# Altium schematic sheet TUSB2036_PINOUT.SchDoc
size B; SheetNumber: 12; SheetTotal: 17
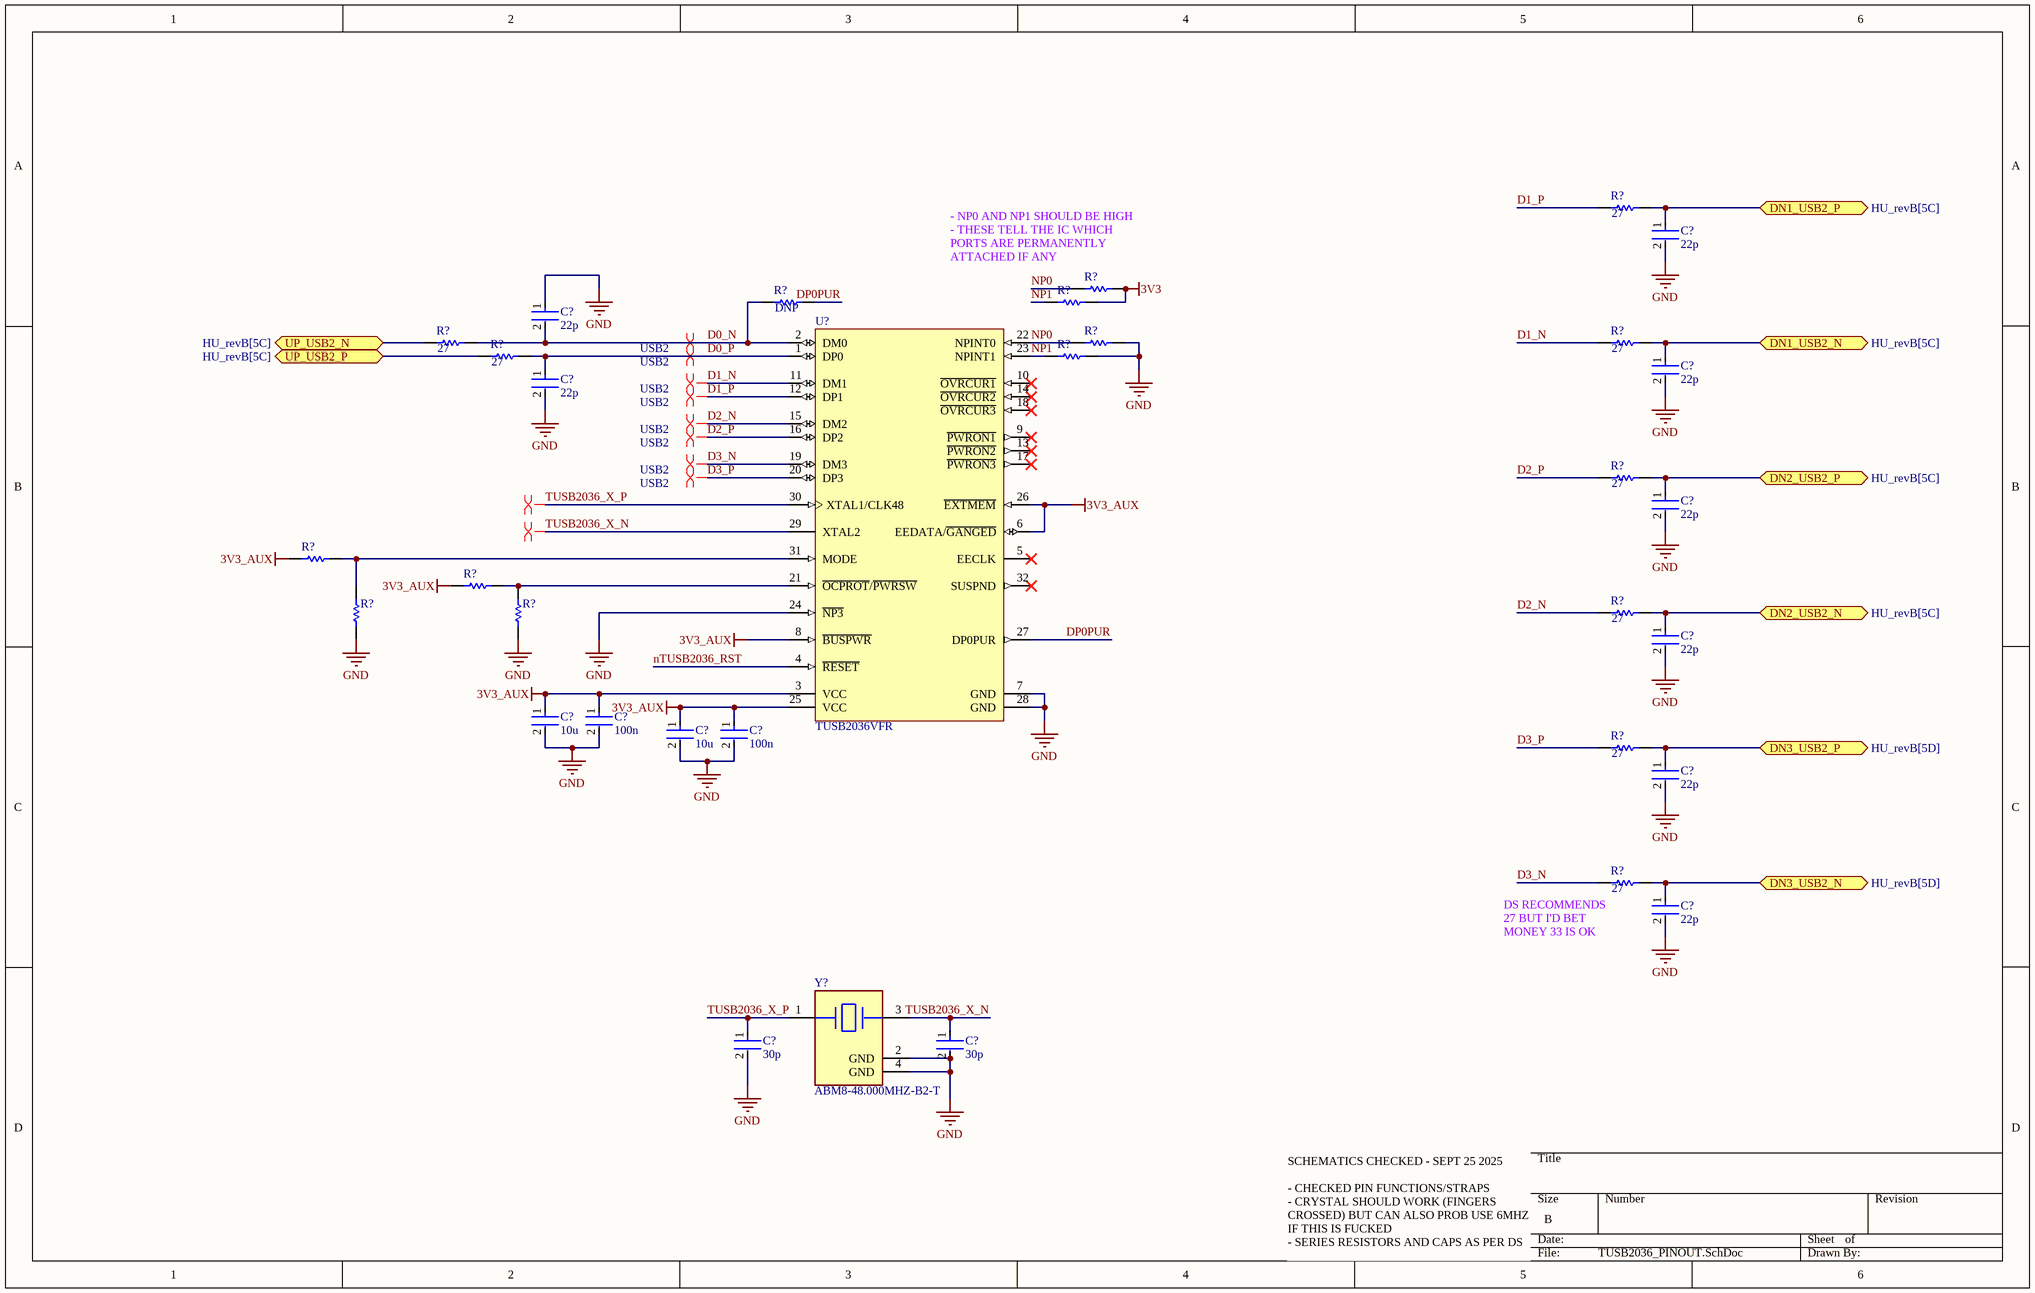
[diagram p0: TUSB2036_PINOUT.SchDoc]

## Parts
(Parts that share a designator on the sheet are numbered #1, #2 ... from top to bottom, then left to right.)
C?#1  22p  [FP-0402-L_1_0_0_05-W_0_5-IPC_A]
C?#2  22p  [FP-0402-L_1_0_0_05-W_0_5-IPC_A]
C?#3  22p  [FP-0402-L_1_0_0_05-W_0_5-IPC_A]
C?#4  22p  [FP-0402-L_1_0_0_05-W_0_5-IPC_A]
C?#5  22p  [FP-0402-L_1_0_0_05-W_0_5-IPC_A]
C?#6  22p  [FP-0402-L_1_0_0_05-W_0_5-IPC_A]
C?#7  10u  [FP-0402-L_1_0_0_05-W_0_5-IPC_A]
C?#8  100n  [FP-0402-L_1_0_0_05-W_0_5-IPC_A]
C?#9  10u  [FP-0402-L_1_0_0_05-W_0_5-IPC_A]
C?#10  100n  [FP-0402-L_1_0_0_05-W_0_5-IPC_A]
C?#11  22p  [FP-0402-L_1_0_0_05-W_0_5-IPC_A]
C?#12  22p  [FP-0402-L_1_0_0_05-W_0_5-IPC_A]
C?#13  30p  [FP-0402-L_1_0_0_05-W_0_5-IPC_A]
C?#14  30p  [FP-0402-L_1_0_0_05-W_0_5-IPC_A]
R?#1  27  [R0603B]
R?#2  0402 JUMPER  [RESC1005X40X25ML05T05]  (value not drawn)
R?#3  0402 JUMPER  [RESC1005X40X25ML05T05]  (value not drawn)
R?#4  DNP  [R0603B]
R?#5  0402 JUMPER  [RESC1005X40X25ML05T05]  (value not drawn)
R?#6  27  [R0603B]
R?#7  0402 JUMPER  [RESC1005X40X25ML05T05]  (value not drawn)
R?#8  27  [R0603B]
R?#9  27  [R0603B]
R?#10  27  [R0603B]
R?#11  0402 JUMPER  [RESC1005X40X25ML05T05]  (value not drawn)
R?#12  0402 JUMPER  [RESC1005X40X25ML05T05]  (value not drawn)
R?#13  27  [R0603B]
R?#14  DNP  [RESC1005X40X25ML05T05]  (value not drawn)
R?#15  DNP  [RESC1005X40X25ML05T05]  (value not drawn)
R?#16  27  [R0603B]
R?#17  27  [R0603B]
U?  TUSB2036VFR  [VF0032A_M]
Y?  ABM8-48.000MHZ-B2-T  [FP-ABM8-MFG]

## Ports
DN1_USB2_N (bidir, see HU_revB[5C]), DN1_USB2_P (bidir, see HU_revB[5C]), DN2_USB2_N (bidir, see HU_revB[5C]), DN2_USB2_P (bidir, see HU_revB[5C]), DN3_USB2_N (bidir, see HU_revB[5D]), DN3_USB2_P (bidir, see HU_revB[5D]), UP_USB2_N (bidir, see HU_revB[5C]), UP_USB2_P (bidir, see HU_revB[5C])

## Nets
3V3: R?#2.2 R?#3.2
3V3_AUX: C?#7.1 C?#8.1 C?#9.1 C?#10.1 R?#11.2 R?#12.2 U?.3(VCC) U?.6(EEDATA/~{GANGED}) U?.8(~{BUSPWR}) U?.25(VCC) U?.26(~{EXTMEM})
GND: C?#1.2 C?#2.1 C?#3.2 C?#4.2 C?#5.2 C?#6.2 C?#7.2 C?#8.2 C?#9.2 C?#10.2 C?#11.2 C?#12.2 C?#13.2 C?#14.2 R?#5.2 R?#7.2 R?#14.1 R?#15.1 U?.7(GND) U?.24(~{NP3}) U?.28(GND) Y?.2(GND) Y?.4(GND)
D0_N: C?#2.2 R?#4.2 R?#6.1 U?.2(DM0)
D0_P: C?#4.1 R?#9.1 U?.1(DP0)
D1_N: R?#8.2 U?.11(DM1)
D1_P: R?#1.2 U?.12(DP1)
D2_N: R?#13.2 U?.15(DM2)
D2_P: R?#10.2 U?.16(DP2)
D3_N: R?#17.2 U?.19(DM3)
D3_P: R?#16.2 U?.20(DP3)
DN1_USB2_N: C?#3.1 R?#8.1 ; port DN1_USB2_N
DN1_USB2_P: C?#1.1 R?#1.1 ; port DN1_USB2_P
DN2_USB2_N: C?#6.1 R?#13.1 ; port DN2_USB2_N
DN2_USB2_P: C?#5.1 R?#10.1 ; port DN2_USB2_P
DN3_USB2_N: C?#12.1 R?#17.1 ; port DN3_USB2_N
DN3_USB2_P: C?#11.1 R?#16.1 ; port DN3_USB2_P
DP0PUR: R?#4.1 U?.27(DP0PUR)
NP0: R?#2.1 R?#5.1 U?.22(NPINT0)
NP1: R?#3.1 R?#7.1 U?.23(NPINT1)
nTUSB2036_RST: U?.4(~{RESET})
TUSB2036_X_N: C?#14.1 U?.29(XTAL2) Y?.3
TUSB2036_X_P: C?#13.1 U?.30(XTAL1/CLK48) Y?.1
UP_USB2_N: R?#6.2 ; port UP_USB2_N
UP_USB2_P: R?#9.2 ; port UP_USB2_P
NetR?#11_1: R?#11.1 R?#14.2 U?.31(MODE)
NetR?#12_1: R?#12.1 R?#15.2 U?.21(~{OCPROT}/~{PWRSW})

Not connected (* = marked no-connect by the designer): U? 5(EECLK)* 9(~{PWRON1})* 10(~{OVRCUR1})* 13(~{PWRON2})* 14(~{OVRCUR2})* 17(~{PWRON3})* 18(~{OVRCUR3})* 32(SUSPND)*

## Layout directives
differential pair: TUSB2036_X_N, TUSB2036_X_P
differential pair; differential pair class USB2: D0_N, D0_P, D1_N, D1_P, D2_N, D2_P, D3_N, D3_P

## Notes on the sheet
- (near R?#2) - NP0 AND NP1 SHOULD BE HIGH
  - THESE TELL THE IC WHICH PORTS ARE PERMANENTLY ATTACHED IF ANY
- (near R?#17) DS RECOMMENDS 27 BUT I'D BET MONEY 33 IS OK
- SCHEMATICS CHECKED - SEPT 25 2025
  - CHECKED PIN FUNCTIONS/STRAPS
  - CRYSTAL SHOULD WORK (FINGERS CROSSED) BUT CAN ALSO PROB USE 6MHZ IF THIS IS FUCKED
  - SERIES RESISTORS AND CAPS AS PER DS

## Library data of the parts
C?#1-C?#14 = CMP-001-00058-1: LARGE PADS, 0402 CAP, CHANGE COMMENT TO MATCH REAL P/N; Capacitor Type: Ceramic; Min Operating Temperature: -55°C; Mounting Technology: Surface Mount; Pins: 2; Case/Package: 0402; RoHS Compliant: Yes; Max Operating Temperature: 85°C
R?#1 R?#4 R?#6 R?#8-R?#10 R?#13 R?#16 R?#17 = CMP-009-00002-14: Resistor
  R?#1 R?#6 R?#8-R?#10 R?#13 R?#16 R?#17: Value: 27
  R?#4: Value: DNP
R?#2 R?#3 R?#5 R?#7 R?#11 R?#12 R?#14 R?#15 = CMP-009-00118-2: READ THE NAME; Pins: 2; Component Type: Standard; Design Item ID: CMP-009-00206-2; Source: 0402jump.SchLib
U? = CMP-0309-00082-2: 2 / 3-Port Hub for USB with Optional Serial EEPROM Interface, 3.3V, 0 to 70 degC, 32-Pin LQFP (VF), Green (RoHS & no Sb/Br); Manufacturer: Texas Instruments; Supply Voltage(s)(V): 3.3; SubFamily: USB Hub Controller; USB Speed: Full; USB Full Speed: True; PackageReference: VF0032A; ComponentLink2URL: http://www.ti.com/litv/pdf/mtqf002b; PackageDescription: 32-Pin Plastic Quad Flatpack, 7 x 7 mm Body, 0.8 mm Pitch; Integrated MCU Architecture: N/A; DatasheetVersion: SLLS372E; ComponentLink1URL: http://www.ti.com/general/docs/lit/getliterature.tsp?genericPartNumber=TUSB2036&fileType=pdf; Eco-Plan: Green (RoHS & no Sb/Br); PartNumber: TUSB2036VFR; Mounting Technology: Surface Mount; ComponentLink1Description: Datasheet; PackageVersion: revD, Apr-2000; ComponentLink2Description: Package Specification
Y? = CMP-27762-011708-1: Crystal 48MHz ±20ppm 18pF SMD-4 3.2mm x 2.5mm; Series Resistance: 35R; Frequency Stability: 50ppm; Package Quantity: 1000; Packaging: Tape and Reel; Mount: Surface Mount; Length: 3.2mm; Load Capacitance: 18pF; Max Operating Temperature: 70°C; Operating Frequency: 48 MHz; RoHS Compliant: Yes; Series: ABM8; Frequency Tolerance: 20ppm; Lead Free: Lead Free; Min Operating Temperature: -20°C; Case/Package: CSMD; Number of Pins: 4; Height: 0.031inch; ESR (Equivalent Series Resistance): 35R; Frequency: 48MHz; Radiation Hardening: No; Width: 0.098inch; Tolerance: 20ppm; Termination: SMD/SMT; Depth: 2.5mm; Resistor Type: Ceramic; REACH SVHC: No SVHC